# Altium schematic sheet 2_FPGA.SchDoc: AX309 Http://www.heijin.org
size OrCAD B; DocumentNumber: 2; Revision: 1.0; SheetNumber: 3; SheetTotal: 8; PageSetup: Record=PageOptions|CenterHorizontal=True|CenterVertical=True|PrintScale=1.03|XCorrection=1.00|YCorrection=1.00|PrintKind=0|BorderSize=5000000|LeftOffset=0|BottomOffset=0|Orientation=2|PaperLength=1000|PaperWidth=1000|Scale=100|PaperSource=15|PrintQuality=1200|MediaType=1|DitherType=10|PrintScaleMode=1|PaperKind=A4|PaperIndex=9
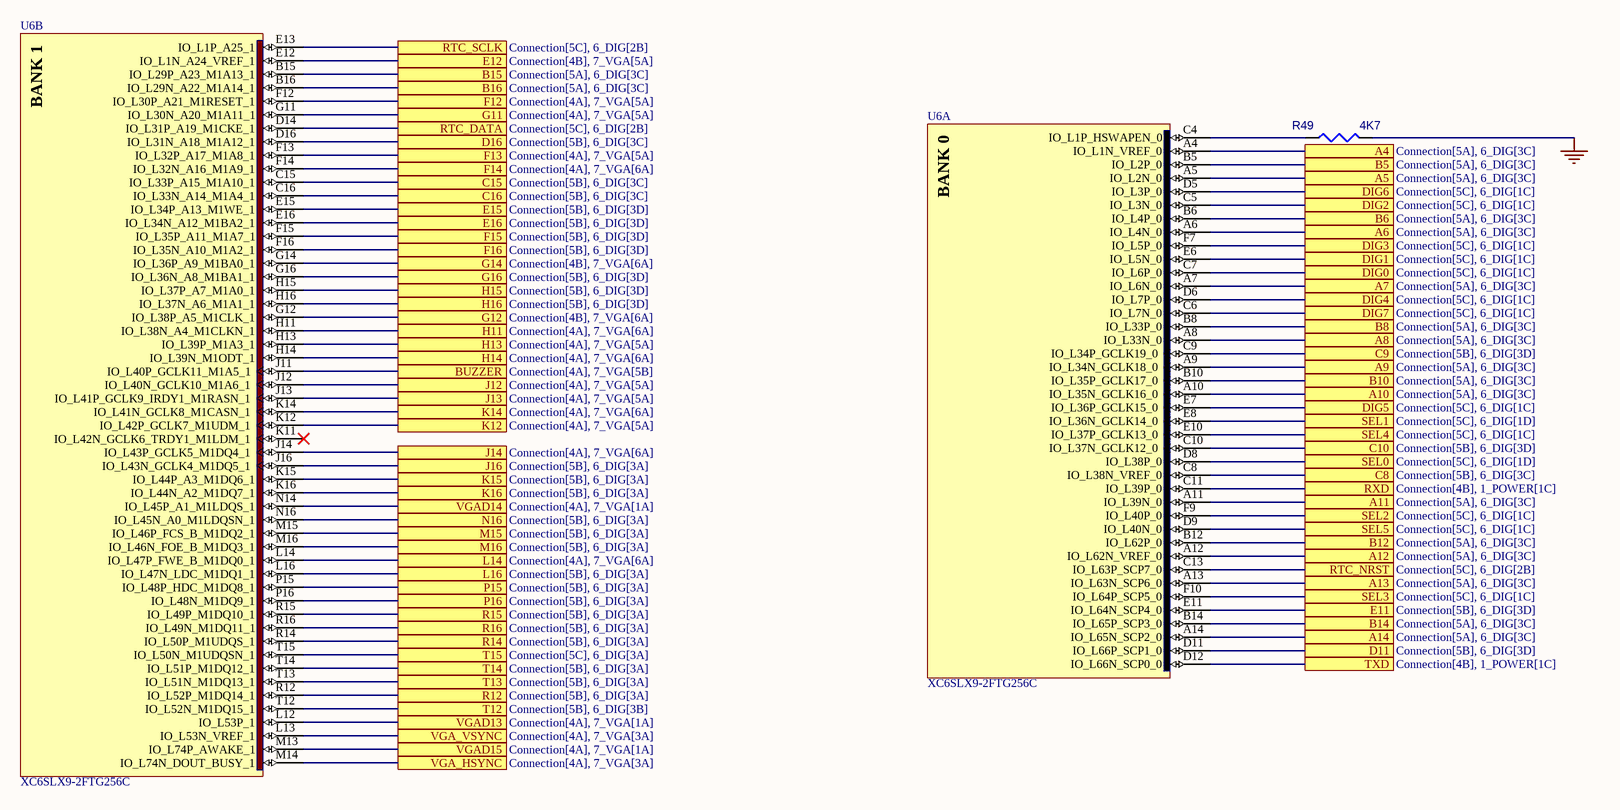
[diagram p0: 2_FPGA.SchDoc]

## Parts
R49  4K7  [0603]
U6  XC6SLX9-2FTG256C  [FTG256]  (parts A,B of 7)

## Ports
A4 (see Connection[5A], 6_DIG[3C]), A5 (see Connection[5A], 6_DIG[3C]), A6 (see Connection[5A], 6_DIG[3C]), A7 (see Connection[5A], 6_DIG[3C]), A8 (see Connection[5A], 6_DIG[3C]), A9 (see Connection[5A], 6_DIG[3C]), A10 (see Connection[5A], 6_DIG[3C]), A11 (see Connection[5A], 6_DIG[3C]), A12 (see Connection[5A], 6_DIG[3C]), A13 (see Connection[5A], 6_DIG[3C]), A14 (see Connection[5A], 6_DIG[3C]), B5 (see Connection[5A], 6_DIG[3C]), B6 (see Connection[5A], 6_DIG[3C]), B8 (see Connection[5A], 6_DIG[3C]), B10 (see Connection[5A], 6_DIG[3C]), B12 (see Connection[5A], 6_DIG[3C]), B14 (see Connection[5A], 6_DIG[3C]), B15 (see Connection[5A], 6_DIG[3C]), B16 (see Connection[5A], 6_DIG[3C]), BUZZER (see Connection[4A], 7_VGA[5B]), C8 (see Connection[5B], 6_DIG[3C]), C9 (see Connection[5B], 6_DIG[3D]), C10 (see Connection[5B], 6_DIG[3D]), C15 (see Connection[5B], 6_DIG[3C]), C16 (see Connection[5B], 6_DIG[3C]), D11 (see Connection[5B], 6_DIG[3D]), D16 (see Connection[5B], 6_DIG[3C]), DIG0 (see Connection[5C], 6_DIG[1C]), DIG1 (see Connection[5C], 6_DIG[1C]), DIG2 (see Connection[5C], 6_DIG[1C]), DIG3 (see Connection[5C], 6_DIG[1C]), DIG4 (see Connection[5C], 6_DIG[1C]), DIG5 (see Connection[5C], 6_DIG[1C]), DIG6 (see Connection[5C], 6_DIG[1C]), DIG7 (see Connection[5C], 6_DIG[1C]), E11 (see Connection[5B], 6_DIG[3D]), E12 (see Connection[4B], 7_VGA[5A]), E15 (see Connection[5B], 6_DIG[3D]), E16 (see Connection[5B], 6_DIG[3D]), F12 (see Connection[4A], 7_VGA[5A]), F13 (see Connection[4A], 7_VGA[5A]), F14 (see Connection[4A], 7_VGA[6A]), F15 (see Connection[5B], 6_DIG[3D]), F16 (see Connection[5B], 6_DIG[3D]), G11 (see Connection[4A], 7_VGA[5A]), G12 (see Connection[4B], 7_VGA[6A]), G14 (see Connection[4B], 7_VGA[6A]), G16 (see Connection[5B], 6_DIG[3D]), H11 (see Connection[4A], 7_VGA[6A]), H13 (see Connection[4A], 7_VGA[5A]), H14 (see Connection[4A], 7_VGA[6A]), H15 (see Connection[5B], 6_DIG[3D]), H16 (see Connection[5B], 6_DIG[3D]), J12 (see Connection[4A], 7_VGA[5A]), J13 (see Connection[4A], 7_VGA[5A]), J14 (see Connection[4A], 7_VGA[6A]), J16 (see Connection[5B], 6_DIG[3A]), K12 (see Connection[4A], 7_VGA[5A]), K14 (see Connection[4A], 7_VGA[6A]), K15 (see Connection[5B], 6_DIG[3A]), K16 (see Connection[5B], 6_DIG[3A]), L14 (see Connection[4A], 7_VGA[6A]), L16 (see Connection[5B], 6_DIG[3A]), M15 (see Connection[5B], 6_DIG[3A]), M16 (see Connection[5B], 6_DIG[3A]), N16 (see Connection[5B], 6_DIG[3A]), P15 (see Connection[5B], 6_DIG[3A]), P16 (see Connection[5B], 6_DIG[3A]), R12 (see Connection[5B], 6_DIG[3A]), R14 (see Connection[5B], 6_DIG[3A]), R15 (see Connection[5B], 6_DIG[3A]), R16 (see Connection[5B], 6_DIG[3A]), RTC_DATA (see Connection[5C], 6_DIG[2B]), RTC_NRST (see Connection[5C], 6_DIG[2B]), RTC_SCLK (see Connection[5C], 6_DIG[2B]), RXD (see Connection[4B], 1_POWER[1C]), SEL0 (see Connection[5C], 6_DIG[1D]), SEL1 (see Connection[5C], 6_DIG[1D]), SEL2 (see Connection[5C], 6_DIG[1C]), SEL3 (see Connection[5C], 6_DIG[1C]), SEL4 (see Connection[5C], 6_DIG[1C]), SEL5 (see Connection[5C], 6_DIG[1C]), T12 (see Connection[5B], 6_DIG[3B]), T13 (see Connection[5B], 6_DIG[3A]), T14 (see Connection[5B], 6_DIG[3A]), T15 (see Connection[5C], 6_DIG[3A]), TXD (see Connection[4B], 1_POWER[1C]), VGA_HSYNC (see Connection[4A], 7_VGA[3A]), VGA_VSYNC (see Connection[4A], 7_VGA[3A]), VGAD13 (see Connection[4A], 7_VGA[1A]), VGAD14 (see Connection[4A], 7_VGA[1A]), VGAD15 (see Connection[4A], 7_VGA[1A])

## Nets
GND: R49.2
A4: U6.A4(IO_L1N_VREF_0) ; port A4
A5: U6.A5(IO_L2N_0) ; port A5
A6: U6.A6(IO_L4N_0) ; port A6
A7: U6.A7(IO_L6N_0) ; port A7
A8: U6.A8(IO_L33N_0) ; port A8
A9: U6.A9(IO_L34N_GCLK18_0) ; port A9
A10: U6.A10(IO_L35N_GCLK16_0) ; port A10
A11: U6.A11(IO_L39N_0) ; port A11
A12: U6.A12(IO_L62N_VREF_0) ; port A12
A13: U6.A13(IO_L63N_SCP6_0) ; port A13
A14: U6.A14(IO_L65N_SCP2_0) ; port A14
B5: U6.B5(IO_L2P_0) ; port B5
B6: U6.B6(IO_L4P_0) ; port B6
B8: U6.B8(IO_L33P_0) ; port B8
B10: U6.B10(IO_L35P_GCLK17_0) ; port B10
B12: U6.B12(IO_L62P_0) ; port B12
B14: U6.B14(IO_L65P_SCP3_0) ; port B14
B15: U6.B15(IO_L29P_A23_M1A13_1) ; port B15
B16: U6.B16(IO_L29N_A22_M1A14_1) ; port B16
BUZZER: U6.J11(IO_L40P_GCLK11_M1A5_1) ; port BUZZER
C8: U6.C8(IO_L38N_VREF_0) ; port C8
C9: U6.C9(IO_L34P_GCLK19_0) ; port C9
C10: U6.C10(IO_L37N_GCLK12_0) ; port C10
C15: U6.C15(IO_L33P_A15_M1A10_1) ; port C15
C16: U6.C16(IO_L33N_A14_M1A4_1) ; port C16
D11: U6.D11(IO_L66P_SCP1_0) ; port D11
D16: U6.D16(IO_L31N_A18_M1A12_1) ; port D16
DIG0: U6.C7(IO_L6P_0) ; port DIG0
DIG1: U6.E6(IO_L5N_0) ; port DIG1
DIG2: U6.C5(IO_L3N_0) ; port DIG2
DIG3: U6.F7(IO_L5P_0) ; port DIG3
DIG4: U6.D6(IO_L7P_0) ; port DIG4
DIG5: U6.E7(IO_L36P_GCLK15_0) ; port DIG5
DIG6: U6.D5(IO_L3P_0) ; port DIG6
DIG7: U6.C6(IO_L7N_0) ; port DIG7
E11: U6.E11(IO_L64N_SCP4_0) ; port E11
E12: U6.E12(IO_L1N_A24_VREF_1) ; port E12
E15: U6.E15(IO_L34P_A13_M1WE_1) ; port E15
E16: U6.E16(IO_L34N_A12_M1BA2_1) ; port E16
F12: U6.F12(IO_L30P_A21_M1RESET_1) ; port F12
F13: U6.F13(IO_L32P_A17_M1A8_1) ; port F13
F14: U6.F14(IO_L32N_A16_M1A9_1) ; port F14
F15: U6.F15(IO_L35P_A11_M1A7_1) ; port F15
F16: U6.F16(IO_L35N_A10_M1A2_1) ; port F16
G11: U6.G11(IO_L30N_A20_M1A11_1) ; port G11
G12: U6.G12(IO_L38P_A5_M1CLK_1) ; port G12
G14: U6.G14(IO_L36P_A9_M1BA0_1) ; port G14
G16: U6.G16(IO_L36N_A8_M1BA1_1) ; port G16
H11: U6.H11(IO_L38N_A4_M1CLKN_1) ; port H11
H13: U6.H13(IO_L39P_M1A3_1) ; port H13
H14: U6.H14(IO_L39N_M1ODT_1) ; port H14
H15: U6.H15(IO_L37P_A7_M1A0_1) ; port H15
H16: U6.H16(IO_L37N_A6_M1A1_1) ; port H16
J12: U6.J12(IO_L40N_GCLK10_M1A6_1) ; port J12
J13: U6.J13(IO_L41P_GCLK9_IRDY1_M1RASN_1) ; port J13
J14: U6.J14(IO_L43P_GCLK5_M1DQ4_1) ; port J14
J16: U6.J16(IO_L43N_GCLK4_M1DQ5_1) ; port J16
K12: U6.K12(IO_L42P_GCLK7_M1UDM_1) ; port K12
K14: U6.K14(IO_L41N_GCLK8_M1CASN_1) ; port K14
K15: U6.K15(IO_L44P_A3_M1DQ6_1) ; port K15
K16: U6.K16(IO_L44N_A2_M1DQ7_1) ; port K16
L14: U6.L14(IO_L47P_FWE_B_M1DQ0_1) ; port L14
L16: U6.L16(IO_L47N_LDC_M1DQ1_1) ; port L16
M15: U6.M15(IO_L46P_FCS_B_M1DQ2_1) ; port M15
M16: U6.M16(IO_L46N_FOE_B_M1DQ3_1) ; port M16
N16: U6.N16(IO_L45N_A0_M1LDQSN_1) ; port N16
P15: U6.P15(IO_L48P_HDC_M1DQ8_1) ; port P15
P16: U6.P16(IO_L48N_M1DQ9_1) ; port P16
R12: U6.R12(IO_L52P_M1DQ14_1) ; port R12
R14: U6.R14(IO_L50P_M1UDQS_1) ; port R14
R15: U6.R15(IO_L49P_M1DQ10_1) ; port R15
R16: U6.R16(IO_L49N_M1DQ11_1) ; port R16
RTC_DATA: U6.D14(IO_L31P_A19_M1CKE_1) ; port RTC_DATA
RTC_NRST: U6.C13(IO_L63P_SCP7_0) ; port RTC_NRST
RTC_SCLK: U6.E13(IO_L1P_A25_1) ; port RTC_SCLK
RXD: U6.C11(IO_L39P_0) ; port RXD
SEL0: U6.D8(IO_L38P_0) ; port SEL0
SEL1: U6.E8(IO_L36N_GCLK14_0) ; port SEL1
SEL2: U6.F9(IO_L40P_0) ; port SEL2
SEL3: U6.F10(IO_L64P_SCP5_0) ; port SEL3
SEL4: U6.E10(IO_L37P_GCLK13_0) ; port SEL4
SEL5: U6.D9(IO_L40N_0) ; port SEL5
T12: U6.T12(IO_L52N_M1DQ15_1) ; port T12
T13: U6.T13(IO_L51N_M1DQ13_1) ; port T13
T14: U6.T14(IO_L51P_M1DQ12_1) ; port T14
T15: U6.T15(IO_L50N_M1UDQSN_1) ; port T15
TXD: U6.D12(IO_L66N_SCP0_0) ; port TXD
VGA_HSYNC: U6.M14(IO_L74N_DOUT_BUSY_1) ; port VGA_HSYNC
VGA_VSYNC: U6.L13(IO_L53N_VREF_1) ; port VGA_VSYNC
VGAD13: U6.L12(IO_L53P_1) ; port VGAD13
VGAD14: U6.N14(IO_L45P_A1_M1LDQS_1) ; port VGAD14
VGAD15: U6.M13(IO_L74P_AWAKE_1) ; port VGAD15
NetR49_1: R49.1 U6.C4(IO_L1P_HSWAPEN_0)

Not connected (* = marked no-connect by the designer): U6 K11(IO_L42N_GCLK6_TRDY1_M1LDM_1)*

## Notes on the sheet
- Title
- Size:
- Date:
- Orcad A
- Number:
- Time:
- Revision:
- Sheet
- of
- File:
- (in symbol XC6SLX9-2FTG256C, part A) BANK 0
- (in symbol XC6SLX9-2FTG256C, part B) BANK 1

## Library data of the parts
R49 = R
U6 = XC6SLX9-2FTG256C: Spartan-6 LX 1.2V FPGA, 186 User I/Os, 256-Ball Fine-Pitch Thin BGA (1.0mm Pitch), Speed Grade 2, Commercial Grade, Pb-Free; DatasheetVersion: ver1.6, Nov-2010; PackageVersion: ver1.3, Oct-2007; PackageReference: FTG256; PackageDescription: 256-Ball Fine Pitch Thin Ball Grid Array 1.00 mm Pitch (FTG256) - Pb-Free; Code_JEDEC: MS-034-AAF-1*; ComponentLink1Description: Manufacturer URL; ComponentLink1URL: http://www.xilinx.com/; ComponentLink2Description: Spartan-6 Datasheet; ComponentLink2URL: http://www.xilinx.com/support/documentation/data_sheets/ds160.pdf; ComponentLink3Description: Spartan-6 Documents; ComponentLink3URL: http://www.xilinx.com/support/documentation/spartan-6.htm